# Altium project MRTRUMAN.PrjPcb (part 3 of 4)

## Sheet 04 DragonBoard_INTF.SchDoc
size 457 x 241 mm
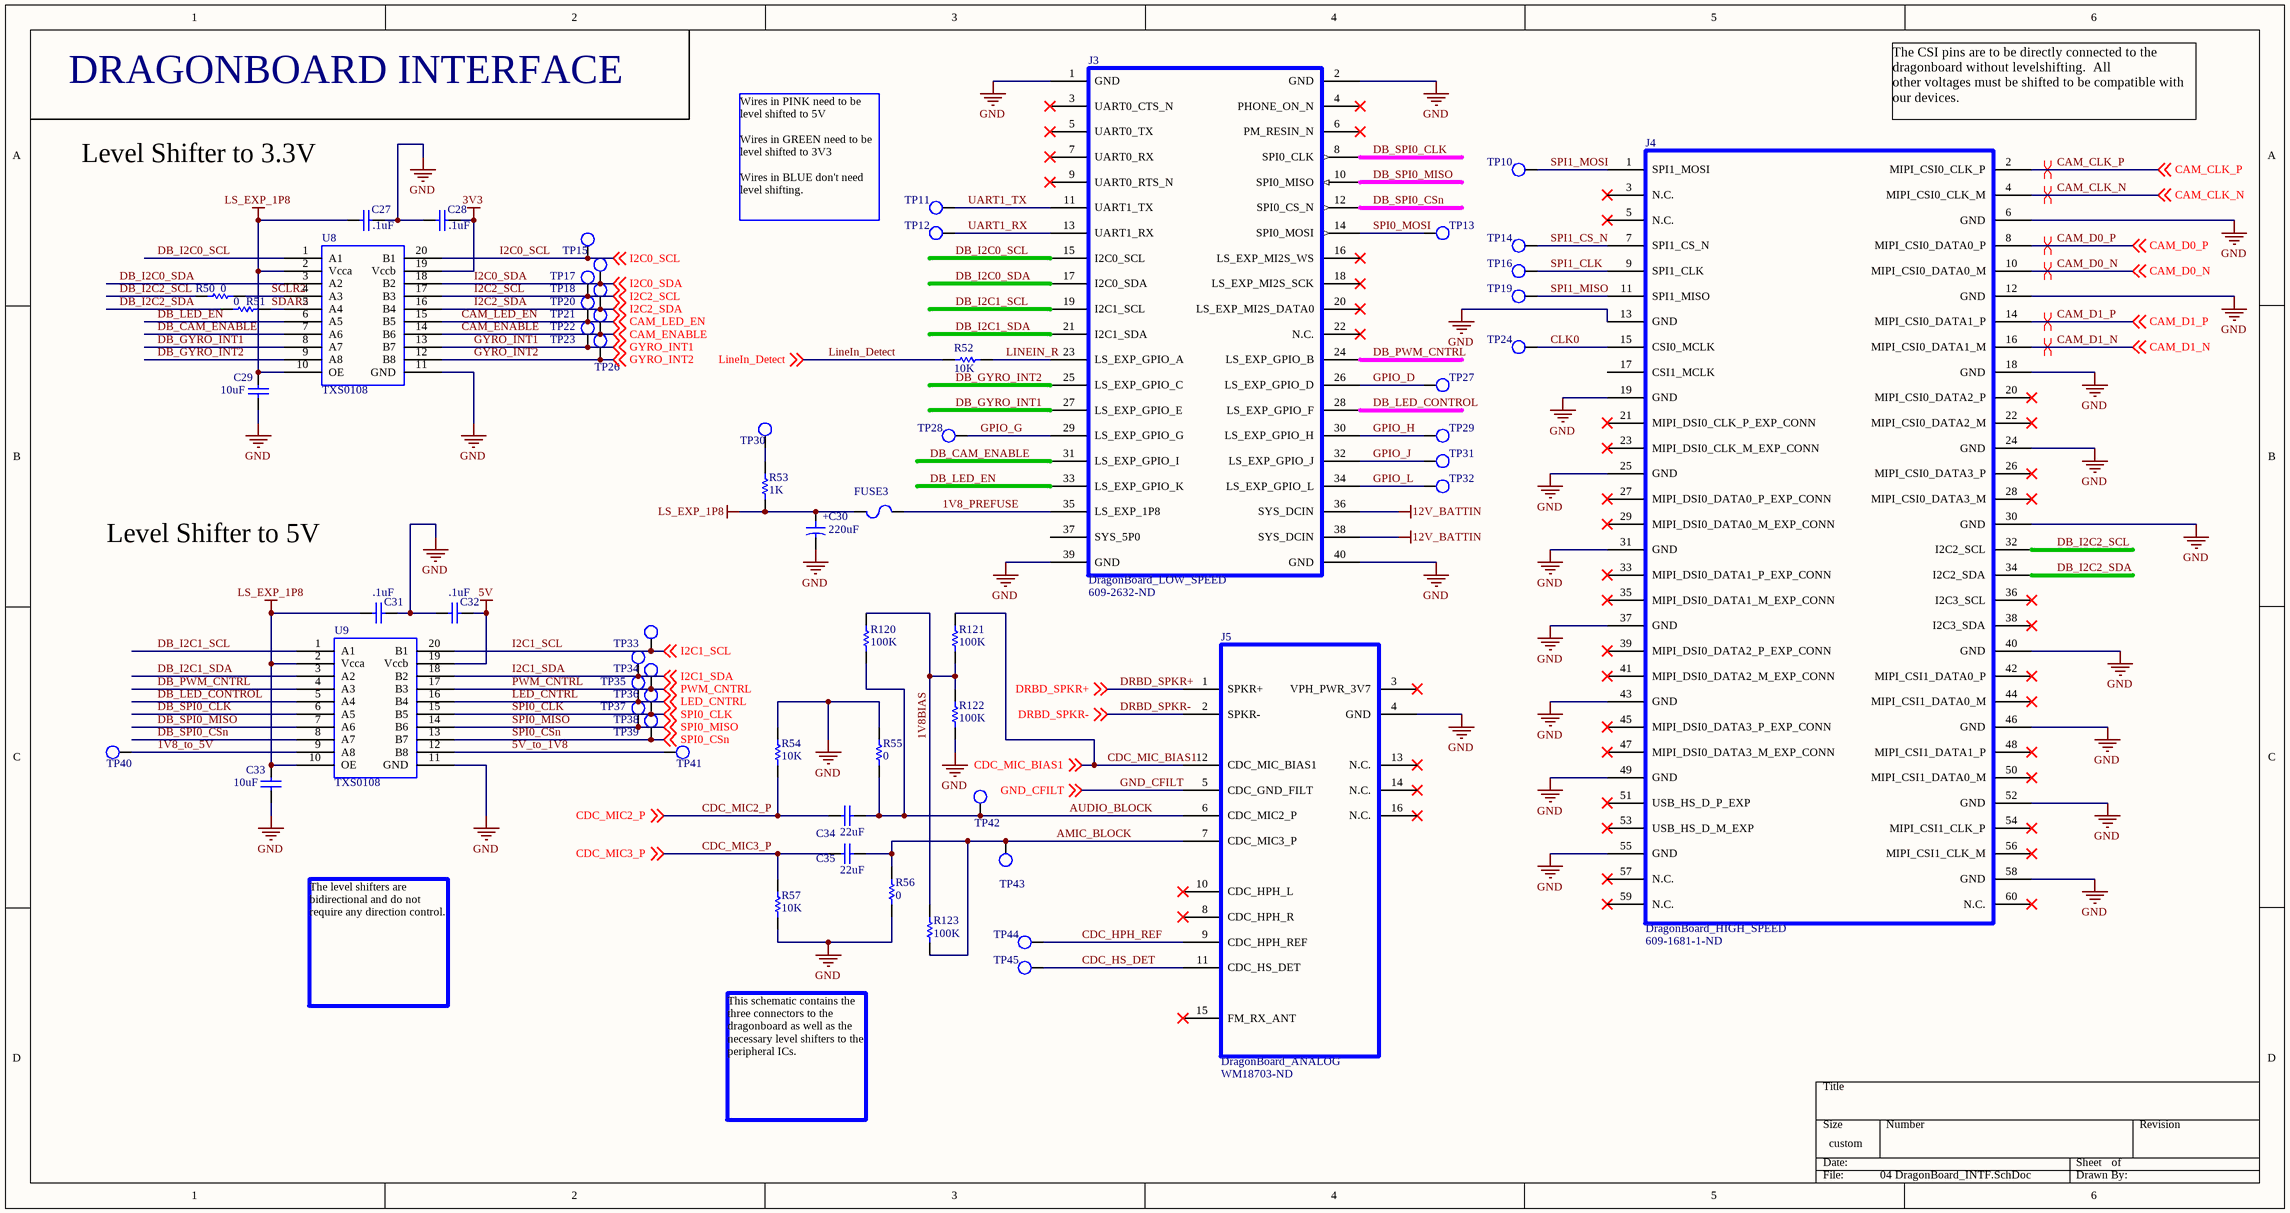
[diagram p3: 04 DragonBoard_INTF.SchDoc]

### Parts
C27  value .1uF  [CAPC2012X135N]  (hidden comment: CAP_0805_.1u_250V)
C28  value .1uF  [CAPC2012X135N]  (hidden comment: CAP_0805_.1u_250V)
C29  value 10uF  [CAPC2012X135N]  (hidden comment: CAP_0805_10u_16V)
C30  Capacitance: 220uF  [CAP_RADIAL]  (hidden comment: CAP ALUM 220UF 20% 25V SMD)
C31  value .1uF  [CAPC2012X135N]  (hidden comment: CAP_0805_.1u_250V)
C32  value .1uF  [CAPC2012X135N]  (hidden comment: CAP_0805_.1u_250V)
C33  value 10uF  [CAPC2012X135N]  (hidden comment: CAP_0805_10u_16V)
C34  value 22uF  [CAPC2012X135N]  (hidden comment: CAP_0805_22u_25V)
C35  value 22uF  [CAPC2012X135N]  (hidden comment: CAP_0805_22u_25V)
FUSE3  FUSE_0805_1A_32VDC  [RES0805]  (value not drawn)
J3  DragonBoard_LOW_SPEED  Supplier Part Number 1: 609-2632-ND  [57202_40_PIN_HEADER]
J4  DragonBoard_HIGH_SPEED  Supplier Part Number 1: 609-1681-1-ND  [DB_HIGH_SPEED]
J5  DragonBoard_ANALOG  Supplier Part Number 1: WM18703-ND  [16_PIN_ANALOG_CONN]
R50  RES_0805_JMP  [RES0805]  (value not drawn)
R51  RES_0805_JMP  [RES0805]  (value not drawn)
R52  Resistance: 10K  [RES0805]  (hidden comment: RES_0805_10K)
R53  RES_0805_1K  [RES0805]  (value not drawn)
R54  Resistance: 10K  [RES0805]  (hidden comment: RES_0805_10K)
R55  RES_0805_JMP  [RES0805]  (value not drawn)
R56  RES_0805_JMP  [RES0805]  (value not drawn)
R57  Resistance: 10K  [RES0805]  (hidden comment: RES_0805_10K)
R120  RES_0805_100K  [RES0805]  (value not drawn)
R121  RES_0805_100K  [RES0805]  (value not drawn)
R122  RES_0805_100K  [RES0805]  (value not drawn)
R123  RES_0805_100K  [RES0805]  (value not drawn)
TP10  TP  [TestPoint_0805]  (value not drawn)
TP11  TP  [TestPoint_0805]  (value not drawn)
TP12  TP  [TestPoint_0805]  (value not drawn)
TP13  TP  [TestPoint_0805]  (value not drawn)
TP14  TP  [TestPoint_0805]  (value not drawn)
TP15  TP  [TestPoint_0805]  (value not drawn)
TP16  TP  [TestPoint_0805]  (value not drawn)
TP17  TP  [TestPoint_0805]  (value not drawn)
TP18  TP  [TestPoint_0805]  (value not drawn)
TP19  TP  [TestPoint_0805]  (value not drawn)
TP20  TP  [TestPoint_0805]  (value not drawn)
TP21  TP  [TestPoint_0805]  (value not drawn)
TP22  TP  [TestPoint_0805]  (value not drawn)
TP23  TP  [TestPoint_0805]  (value not drawn)
TP24  TP  [TestPoint_0805]  (value not drawn)
TP26  TP  [TestPoint_0805]  (value not drawn)
TP27  TP  [TestPoint_0805]  (value not drawn)
TP28  TP  [TestPoint_0805]  (value not drawn)
TP29  TP  [TestPoint_0805]  (value not drawn)
TP30  TP  [TestPoint_0805]  (value not drawn)
TP31  TP  [TestPoint_0805]  (value not drawn)
TP32  TP  [TestPoint_0805]  (value not drawn)
TP33  TP  [TestPoint_0805]  (value not drawn)
TP34  TP  [TestPoint_0805]  (value not drawn)
TP35  TP  [TestPoint_0805]  (value not drawn)
TP36  TP  [TestPoint_0805]  (value not drawn)
TP37  TP  [TestPoint_0805]  (value not drawn)
TP38  TP  [TestPoint_0805]  (value not drawn)
TP39  TP  [TestPoint_0805]  (value not drawn)
TP40  TP  [TestPoint_0805]  (value not drawn)
TP41  TP  [TestPoint_0805]  (value not drawn)
TP42  TP  [TestPoint_0805]  (value not drawn)
TP43  TP  [TestPoint_0805]  (value not drawn)
TP44  TP  [TestPoint_0805]  (value not drawn)
TP45  TP  [TestPoint_0805]  (value not drawn)
U8  TXS0108  [TSSOP20]
U9  TXS0108  [TSSOP20]

### Nets
3V3: C28.2 U8.19(Vccb)
5V: C32.2 U9.19(Vccb)
12V_BATTIN: J3.36(SYS_DCIN) J3.38(SYS_DCIN)
GND: C27.2 C28.1 C29.1 C30.2 C31.2 C32.1 C33.1 J3.1(GND) J3.2(GND) J3.39(GND) J3.40(GND) J4.6(GND) J4.12(GND) J4.13(GND) J4.18(GND) J4.19(GND) J4.24(GND) J4.25(GND) J4.30(GND) J4.31(GND) J4.37(GND) J4.40(GND) J4.43(GND) J4.46(GND) J4.49(GND) J4.52(GND) J4.55(GND) J4.58(GND) J5.4(GND) R54.2 R55.2 R56.1 R57.1 R122.1 U8.11(GND) U9.11(GND)
LS_EXP_1P8: C27.1 C29.2 C30.1 C31.1 C33.2 FUSE3.1 R53.1 U8.2(Vcca) U8.10(OE) U9.2(Vcca) U9.10(OE)
1V8_PREFUSE: FUSE3.2 J3.35(LS_EXP_1P8)
1V8_to_5V: TP40.1 U9.9(A8)
1V8BIAS: R120.2 R121.1 R122.2 R123.2
5V_to_1V8: TP41.1 U9.12(B8)
AMIC_BLOCK: C35.2 J5.7(CDC_MIC3_P) R56.2 R123.1 TP43.1
AUDIO_BLOCK: C34.2 J5.6(CDC_MIC2_P) R55.1 R120.1 TP42.1
CAM_CLK_N: J4.4(MIPI_CSI0_CLK_M) ; off-sheet CAM_CLK_N
CAM_CLK_P: J4.2(MIPI_CSI0_CLK_P) ; off-sheet CAM_CLK_P
CAM_D0_N: J4.10(MIPI_CSI0_DATA0_M) ; off-sheet CAM_D0_N
CAM_D0_P: J4.8(MIPI_CSI0_DATA0_P) ; off-sheet CAM_D0_P
CAM_D1_N: J4.16(MIPI_CSI0_DATA1_M) ; off-sheet CAM_D1_N
CAM_D1_P: J4.14(MIPI_CSI0_DATA1_P) ; off-sheet CAM_D1_P
CAM_ENABLE: TP22.1 U8.14(B6) ; off-sheet CAM_ENABLE
CAM_LED_EN: TP21.1 U8.15(B5) ; off-sheet CAM_LED_EN
CDC_HPH_REF: J5.9(CDC_HPH_REF) TP44.1
CDC_HS_DET: J5.11(CDC_HS_DET) TP45.1
CDC_MIC2_P: C34.1 R54.1 ; off-sheet CDC_MIC2_P
CDC_MIC3_P: C35.1 R57.2 ; off-sheet CDC_MIC3_P
CDC_MIC_BIAS1: J5.12(CDC_MIC_BIAS1) R121.2 ; off-sheet CDC_MIC_BIAS1
CLK0: J4.15(CSI0_MCLK) TP24.1
DB_CAM_ENABLE: J3.31(LS_EXP_GPIO_I) U8.7(A6)
DB_GYRO_INT1: J3.27(LS_EXP_GPIO_E) U8.8(A7)
DB_GYRO_INT2: J3.25(LS_EXP_GPIO_C) U8.9(A8)
DB_I2C0_SCL: J3.15(I2C0_SCL) U8.1(A1)
DB_I2C0_SDA: J3.17(I2C0_SDA) U8.3(A2)
DB_I2C1_SCL: J3.19(I2C1_SCL) U9.1(A1)
DB_I2C1_SDA: J3.21(I2C1_SDA) U9.3(A2)
DB_I2C2_SCL: J4.32(I2C2_SCL) R50.1
DB_I2C2_SDA: J4.34(I2C2_SDA) R51.1
DB_LED_CONTROL: J3.28(LS_EXP_GPIO_F) U9.5(A4)
DB_LED_EN: J3.33(LS_EXP_GPIO_K) U8.6(A5)
DB_PWM_CNTRL: J3.24(LS_EXP_GPIO_B) U9.4(A3)
DB_SPI0_CLK: J3.8(SPI0_CLK) U9.6(A5)
DB_SPI0_CSn: J3.12(SPI0_CS_N) U9.8(A7)
DB_SPI0_MISO: J3.10(SPI0_MISO) U9.7(A6)
DRBD_SPKR+: J5.1(SPKR+) ; off-sheet DRBD_SPKR+
DRBD_SPKR-: J5.2(SPKR-) ; off-sheet DRBD_SPKR-
GND_CFILT: J5.5(CDC_GND_FILT) ; off-sheet GND_CFILT
GPIO_D: J3.26(LS_EXP_GPIO_D) TP27.1
GPIO_G: J3.29(LS_EXP_GPIO_G) TP28.1
GPIO_H: J3.30(LS_EXP_GPIO_H) TP29.1
GPIO_J: J3.32(LS_EXP_GPIO_J) TP31.1
GPIO_L: J3.34(LS_EXP_GPIO_L) TP32.1
GYRO_INT1: TP23.1 U8.13(B7) ; off-sheet GYRO_INT1
GYRO_INT2: TP26.1 U8.12(B8) ; off-sheet GYRO_INT2
I2C0_SCL: TP15.1 U8.20(B1) ; off-sheet I2C0_SCL
I2C0_SDA: TP17.1 U8.18(B2) ; off-sheet I2C0_SDA
I2C1_SCL: TP33.1 U9.20(B1) ; off-sheet I2C1_SCL
I2C1_SDA: TP34.1 U9.18(B2) ; off-sheet I2C1_SDA
I2C2_SCL: TP18.1 U8.17(B3) ; off-sheet I2C2_SCL
I2C2_SDA: TP20.1 U8.16(B4) ; off-sheet I2C2_SDA
LED_CNTRL: TP36.1 U9.16(B4) ; off-sheet LED_CNTRL
LineIn_Detect: R52.1 ; off-sheet LineIn_Detect
LINEIN_R: J3.23(LS_EXP_GPIO_A) R52.2
PWM_CNTRL: TP35.1 U9.17(B3) ; off-sheet PWM_CNTRL
SCLR2: R50.2 U8.4(A3)
SDAR2: R51.2 U8.5(A4)
SPI0_CLK: TP37.1 U9.15(B5) ; off-sheet SPI0_CLK
SPI0_CSn: TP39.1 U9.13(B7) ; off-sheet SPI0_CSn
SPI0_MISO: TP38.1 U9.14(B6) ; off-sheet SPI0_MISO
SPI0_MOSI: J3.14(SPI0_MOSI) TP13.1
SPI1_CLK: J4.9(SPI1_CLK) TP16.1
SPI1_CS_N: J4.7(SPI1_CS_N) TP14.1
SPI1_MISO: J4.11(SPI1_MISO) TP19.1
SPI1_MOSI: J4.1(SPI1_MOSI) TP10.1
UART1_RX: J3.13(UART1_RX) TP12.1
UART1_TX: J3.11(UART1_TX) TP11.1
NetR53_2: R53.2 TP30.1

Not connected (* = marked no-connect by the designer): J3 3(UART0_CTS_N)* 4(PHONE_ON_N)* 5(UART0_TX)* 6(PM_RESIN_N)* 7(UART0_RX)* 9(UART0_RTS_N)* 16(LS_EXP_MI2S_WS)* 18(LS_EXP_MI2S_SCK)* 20(LS_EXP_MI2S_DATA0)* 22(N.C.)* 37(SYS_5P0); J4 3(N.C.)* 5(N.C.)* 17(CSI1_MCLK) 20(MIPI_CSI0_DATA2_P)* 21(MIPI_DSI0_CLK_P_EXP_CONN)* 22(MIPI_CSI0_DATA2_M)* 23(MIPI_DSI0_CLK_M_EXP_CONN)* 26(MIPI_CSI0_DATA3_P)* 27(MIPI_DSI0_DATA0_P_EXP_CONN)* 28(MIPI_CSI0_DATA3_M)* 29(MIPI_DSI0_DATA0_M_EXP_CONN)* 33(MIPI_DSI0_DATA1_P_EXP_CONN)* 35(MIPI_DSI0_DATA1_M_EXP_CONN)* 36(I2C3_SCL)* 38(I2C3_SDA)* 39(MIPI_DSI0_DATA2_P_EXP_CONN)* 41(MIPI_DSI0_DATA2_M_EXP_CONN)* 42(MIPI_CSI1_DATA0_P)* 44(MIPI_CSI1_DATA0_M)* 45(MIPI_DSI0_DATA3_P_EXP_CONN)* 47(MIPI_DSI0_DATA3_M_EXP_CONN)* 48(MIPI_CSI1_DATA1_P)* 50(MIPI_CSI1_DATA0_M)* 51(USB_HS_D_P_EXP)* 53(USB_HS_D_M_EXP)* 54(MIPI_CSI1_CLK_P)* 56(MIPI_CSI1_CLK_M)* 57(N.C.)* 59(N.C.)* 60(N.C.)*; J5 3(VPH_PWR_3V7)* 8(CDC_HPH_R)* 10(CDC_HPH_L)* 13(N.C.)* 14(N.C.)* 15(FM_RX_ANT)* 16(N.C.)*

### Layout directives
differential pair: CAM_CLK_N, CAM_CLK_P, CAM_D0_N, CAM_D0_P, CAM_D1_N, CAM_D1_P

### Notes on the sheet
- DRAGONBOARD INTERFACE
- The CSI pins are to be directly connected to the dragonboard without levelshifting.  All
  other voltages must be shifted to be compatible with our devices.
- Level Shifter to 3.3V
- Wires in PINK need to be level shifted to 5V
  Wires in GREEN need to be level shifted to 3V3
  Wires in BLUE don't need level shifting.
- Level Shifter to 5V
- The level shifters are bidirectional and do not require any direction control.
- This schematic contains the three connectors to the dragonboard as well as the necessary level shifters to the peripheral ICs.
- (in symbol CAP_RAD_220u_25V) +
- (in symbol RES_0805_1K) 1K
- (in symbol RES_0805_100K) 100K
- (in symbol RES_0805_JMP) 0

### Library data of the parts
C27 C28 C31 C32 = CAP_0805_.1u_250V: Cap Ceramic 0.1uF 250V X7T 10% SMD 0805 125C Plastic T/R; Manufacturer: TDK; Manufacturer Part Number: C2012X7T2E104K125AE; Capacitance: 100nF; Supplier 1: Digi-Key; Supplier Part Number 1: 445-8883-1-ND; Stock 1: 30376; Pricing 1: 1=0.37, 10=0.25, 100=0.1419, 500=0.1002, 1000=0.0877 (USD); Case/Package: 0805; Weight: 0.000194oz; Case Code (Metric): 2012; Case Code (Imperial): 0805; Min Operating Temperature: -55°C; Max Operating Temperature: 125°C; Package Quantity: 1; Voltage Rating: 250V; Tolerance: 10%; Packaging: Tape and Reel; Voltage Rating (DC): 250V; Dielectric: X7T; Termination: SMD/SMT; Composition: Ceramic; Length: 2mm; Height: 1.25mm; Width: 0.05inch; Thickness: 0.049inch; Depth: 1.25mm; REACH SVHC: No SVHC; ComponentLink1URL: https://datasheet.ciiva.com/24219/c2012x7t2e104k125ae-265154-24219519.pdf; ComponentLink1Description: https://datasheet.ciiva.com/24219/c2012x7t2e104k125ae-265154-24219519.pdf
C29 C33 = CAP_0805_10u_16V: Cap Ceramic 10uF 16V X5R 10% SMD 0805 85C T/R; Manufacturer: Johanson Dielectrics; Manufacturer Part Number: 160R15X106KV4E; Supplier 1: Digi-Key; Supplier Part Number 1: 709-1229-1-ND; Stock 1: 36636; Pricing 1: 1=0.55, 10=0.387, 100=0.2552, 500=0.189, 1000=0.1607 (USD); Mount: Surface Mount; Case/Package: 0805; Number of Pins: 2; Weight: 0.000194oz; Case Code (Imperial): 0805; Case Code (Metric): 2012; Min Operating Temperature: -55°C; Max Operating Temperature: 85°C; Voltage Rating: 16V; Capacitance: 10uF; Voltage Rating (DC): 16V; Tolerance: 10%; Packaging: Tape and Reel; Package Quantity: 2000; Dielectric: X5R; Termination: SMD/SMT; Length: 2.03mm; Height: 1.27mm; Width: 1.27mm; Thickness: 0.06inch; Depth: 1.27mm; Radiation Hardening: No; REACH SVHC: No SVHC; ComponentLink1URL: https://datasheet.ciiva.com/26948/getdatasheetpartid-132904-26948555.pdf; ComponentLink1Description: https://datasheet.ciiva.com/26948/getdatasheetpartid-132904-26948555.pdf
C30 = CAP_RAD_220u_25V: Manufacturer: Nichicon; Manufacturer Part Number: UWT1E221MNL1GS; Dielectric Material: Aluminium; Ripple Current: 155mA; Leakage Current: 3uA; Life (Hours): 1000Hour; Dissipation Factor: 0.16%; Supplier 1: Digi-Key; Stock 1: 22315; Pricing 1: 1=0.44, 10=0.309, 100=0.2034 (USD); Mount: Surface Mount; Case/Package: SMD/SMT; Number of Pins: 2; Min Operating Temperature: -55°C; Max Operating Temperature: 105°C; Tolerance: 20%; Package Quantity: 500; Voltage Rating: 25V; Packaging: Tape and Reel; Ripple Current (AC): 155mA; Voltage Rating (DC): 25V; Termination: SMD/SMT; Voltage: 25V; Diameter: 8mm; Length: 10mm; Height: 10mm; Height - Seated (Max): 0.394inch; Lead Pitch: 3.1mm; Radiation Hardening: No; REACH SVHC: No SVHC; Lead Free: Lead Free; ComponentLink1URL: https://datasheet.ciiva.com/97/e-wt-97056.pdf; ComponentLink1Description: https://datasheet.ciiva.com/97/e-wt-97056.pdf; ComponentLink2URL: https://datasheet.ciiva.com/97/e-wt-97057.pdf; ComponentLink2Description: https://datasheet.ciiva.com/97/e-wt-97057.pdf; ComponentLink3URL: https://datasheet.ciiva.com/30522/getdatasheetpartid-450026-30522226.pdf; ComponentLink3Description: https://datasheet.ciiva.com/30522/getdatasheetpartid-450026-30522226.pdf; ComponentLink4URL: https://datasheet.ciiva.com/5360/e-wt-30307-5360729.pdf; ComponentLink4Description: https://datasheet.ciiva.com/5360/e-wt-30307-5360729.pdf; ComponentLink5URL: https://datasheet.ciiva.com/7851/e-wt-7851755.pdf; ComponentLink5Description: https://datasheet.ciiva.com/7851/e-wt-7851755.pdf; ComponentLink6URL: https://datasheet.ciiva.com/17526/e-wt-17526956.pdf; ComponentLink6Description: https://datasheet.ciiva.com/17526/e-wt-17526956.pdf; ComponentLink7URL: https://datasheet.ciiva.com/28458/1910938-28458412.pdf; ComponentLink7Description: https://datasheet.ciiva.com/28458/1910938-28458412.pdf; ComponentLink8URL: https://datasheet.ciiva.com/97/e-wt-97055.pdf; ComponentLink8Description: https://datasheet.ciiva.com/97/e-wt-97055.pdf; Supplier Part Number 1: 493-2192-1-ND
C34 C35 = CAP_0805_22u_25V: 22µF ±20% 25V X5R Ceramic Capacitor -55°C ~ 85°C Surface Mount, MLCC 0805 (2012 Metric) 0.079" L x 0.049" W (2.00mm x 1.25mm); Manufacturer: Samsung; Manufacturer Part Number: CL21A226MAQNNNE; Supplier 1: Digi-Key; Supplier Part Number 1: 1276-2908-1-ND; Stock 1: 536403; Pricing 1: 1=0.92, 10=0.678, 100=0.465, 500=0.3681, 1000=0.31 (USD); Mount: Surface Mount; Case/Package: 0805; Case Code (Metric): 2012; Case Code (Imperial): 0805; Contact Plating: Nickel,Tin; Min Operating Temperature: -55°C; Max Operating Temperature: 85°C; Package Quantity: 1; Packaging: Tape and Reel; Capacitance: 22uF; Tolerance: 20%; Voltage Rating: 25V; Dielectric: X5R; Termination: Wraparound; Length: 2mm; Width: 0.049inch; Thickness: 0.055inch; Depth: 1.25mm; ComponentLink1URL: https://datasheet.ciiva.com/25724/cl21a226maqnnne-25724468.pdf; ComponentLink1Description: https://datasheet.ciiva.com/25724/cl21a226maqnnne-25724468.pdf
FUSE3 = FUSE_0805_1A_32VDC: FUSE 1.00A 0805 VFAST SMD; Manufacturer: Vishay; Manufacturer Part Number: MFU0805FF01000P100; Voltage Rating (DC): 32V; Current Rating: 1A; DC Cold Resistance: 185mR; Approvals: UL; Supplier 1: Digi-Key; Stock 1: 41804; Pricing 1: 1=0.49, 5=0.474, 10=0.459, 50=0.3866, 100=0.3209, 250=0.2917, 500=0.248 (USD); Mount: Surface Mount; Case/Package: 0805; Case Code (Metric): 2012; Case Code (Imperial): 0805; Housing Material: Ceramic; Min Operating Temperature: -55°C; Max Operating Temperature: 125°C; Package Quantity: 1000; Packaging: Tape and Reel; Fuse Current: 1A; Length: 0.079inch; Height: 0.018inch; Width: 0.049inch; Depth: 1.25mm; REACH SVHC: Unknown; Lead Free: Lead Free; ComponentLink1URL: https://datasheet.ciiva.com/22662/1913674-22662919.pdf; ComponentLink1Description: https://datasheet.ciiva.com/22662/1913674-22662919.pdf; ComponentLink2URL: https://datasheet.ciiva.com/3018/mfuserie-3018078.pdf; ComponentLink2Description: https://datasheet.ciiva.com/3018/mfuserie-3018078.pdf; Supplier Part Number 1: MFU08051.00CT-ND
J3 = DragonBoard_LOW_SPEED: 40 Positions Header, Unshrouded Connector 0.079" (2.00mm) Surface Mount Gold, GXT™; Manufacturer: Amphenol FCI; Manufacturer Part Number: 57202-G52-20LF; Number of Positions: 40; Insulation Resistance: 1GR; Max Voltage Rating (AC): 650V; Gender: Male; Connector Type: Male Pin; Contact Resistance: 25mR; Current Rating: 2A; Pitch: 2mm; Row Spacing: 0.079inch; Mating Post Length: 4mm; Supplier 1: Digi-Key; Stock 1: 3189; Pricing 1: 1=4.58, 10=4.395, 100=3.6624, 500=3.113, 1000=2.6552 (USD); Mount: Surface Mount; Contact Plating: Nickel,Gold,GXT; Contact Material: Bronze,Copper Alloy; Colour: Black; Housing Colour: Black; Housing Material: Thermoplastic; Min Operating Temperature: -55°C; Max Operating Temperature: 125°C; Package Quantity: 100; Packaging: Bulk; Number of Rows: 2; Termination: Solder; Number of Contacts: 40; Orientation: Straight; Contact Gender: Male; Voltage Rating: 650V; Length: 40mm; Depth: 4mm; Width: 4mm; Contact Mating Length: 0.157inch; Radiation Hardening: No; REACH SVHC: No SVHC; Lead Free: Lead Free; ComponentLink1URL: https://datasheet.ciiva.com/9473/57202-9473862.pdf; ComponentLink1Description: https://datasheet.ciiva.com/9473/57202-9473862.pdf; ComponentLink2URL: https://datasheet.ciiva.com/711/57202-711726.pdf; ComponentLink2Description: https://datasheet.ciiva.com/711/57202-711726.pdf
J4 = DragonBoard_HIGH_SPEED: 60 Position Connector Plug, Center Strip Contacts Surface Mount Gold; Manufacturer: Amphenol FCI; Manufacturer Part Number: 61083-064402LF; Contact Resistance: 50mR; Number of Positions: 60; Max Voltage Rating (AC): 100V; Current Rating: 500mA; Gender: Male; Pitch: 0.8mm; Stack Height: 7.7mm; Supplier 1: Digi-Key; Stock 1: 579; Pricing 1: 1=6.36, 10=6.094, 25=5.5644, 50=5.2994, 100=5.0344, 250=4.5044 (USD); Mount: Surface Mount; Case/Package: SMD/SMT; Contact Plating: Nickel,Gold; Contact Material: Brass,Copper Alloy; Housing Material: Polymer; Min Operating Temperature: -40°C; Max Operating Temperature: 125°C; Number of Rows: 2; Packaging: Tape and Reel; Package Quantity: 600; Connector Type: Plug; Termination: Solder; Number of Contacts: 60; Orientation: Straight; Voltage Rating: 100V; Length: 29.8mm; Depth: 6mm; Width: 6mm; Lead Free: Lead Free; Flammability Rating: UL94 V-0; ComponentLink1URL: https://datasheet.ciiva.com/15208/getdatasheetpartid-64898-15208309.pdf; ComponentLink1Description: https://datasheet.ciiva.com/15208/getdatasheetpartid-64898-15208309.pdf; ComponentLink2URL: https://datasheet.ciiva.com/17088/70248518-17088294.pdf; ComponentLink2Description: https://datasheet.ciiva.com/17088/70248518-17088294.pdf; ComponentLink3URL: https://datasheet.ciiva.com/394/61083-394311.pdf; ComponentLink3Description: https://datasheet.ciiva.com/394/61083-394311.pdf; ComponentLink4URL: https://datasheet.ciiva.com/5129/61083-5129495.pdf; ComponentLink4Description: https://datasheet.ciiva.com/5129/61083-5129495.pdf; ComponentLink5URL: https://datasheet.ciiva.com/10034/61083-10034439.pdf; ComponentLink5Description: https://datasheet.ciiva.com/10034/61083-10034439.pdf; ComponentLink6URL: https://datasheet.ciiva.com/394/61083-394312.pdf; ComponentLink6Description: https://datasheet.ciiva.com/394/61083-394312.pdf; ComponentLink7URL: https://datasheet.ciiva.com/394/61083-394313.pdf; ComponentLink7Description: https://datasheet.ciiva.com/394/61083-394313.pdf
J5 = DragonBoard_ANALOG: Conn Socket Strip RCP 16 POS 2mm Solder ST SMD Tube; Manufacturer: Molex; Manufacturer Part Number: 0791091007; Connector Type: Receptacle,Socket; Number of Positions: 16; Gender: Female; Max Voltage Rating (AC): 125V; Contact Resistance: 25mR; Row Spacing: 0.079inch; Supplier 1: Digi-Key; Stock 1: 8937; Pricing 1: 1=2.66, 10=2.554, 100=2.1284, 500=1.8091, 1000=1.5431, 5000=1.3835 (USD); Case/Package: SMD/SMT; Colour: Black; Contact Plating: Nickel,Gold; Contact Material: Bronze; Housing Colour: Black; Housing Material: Polymer; Min Operating Temperature: -55°C; Max Operating Temperature: 105°C; Packaging: Rail/Tube; Number of Rows: 2; Termination: Solder; Number of Contacts: 16; Orientation: Straight; Length: 16.19mm; Pitch: 2mm; Depth: 4.19mm; ComponentLink1URL: https://datasheet.ciiva.com/10078/0791091007-pcb-receptacles-10078749.pdf; ComponentLink1Description: https://datasheet.ciiva.com/10078/0791091007-pcb-receptacles-10078749.pdf
R50 R51 R55 R56 = RES_0805_JMP: RES, THICK FILM, 0R, 0.125W, 0805; Manufacturer: Yageo; Manufacturer Part Number: RC0805JR-070RL; Resistance: 0mR; Tolerance: 5%; Voltage Rating: 150V; Power Rating: 125mW; Temperature Coefficient: 200ppm/°C; Supplier 1: Digi-Key; Supplier Part Number 1: 311-0.0ARCT-ND; Stock 1: 6469744; Pricing 1: 1=0.1, 10=0.018, 25=0.0128, 50=0.0096, 100=0.0071, 250=0.0054, 500=0.0044, 1000=0.0032 (USD); Case/Package: 0805; Number of Pins: 2; Case Code (Imperial): 0805; Case Code (Metric): 2012; Contact Plating: Tin,Matte; Min Operating Temperature: -55°C; Max Operating Temperature: 155°C; Packaging: Tape and Reel; Voltage Rating (DC): 150V; Termination: SMD/SMT; Composition: Thick Film; Military Standard: Not; Length: 2mm; Height: 0.5mm; Width: 1.25mm; Depth: 1.25mm; Radiation Hardening: No; REACH SVHC: Unknown; Lead Free: Lead Free; ComponentLink1URL: https://datasheet.ciiva.com/7941/1738694-7941861.pdf; ComponentLink1Description: https://datasheet.ciiva.com/7941/1738694-7941861.pdf; ComponentLink2URL: https://datasheet.ciiva.com/7941/1738694-7941862.pdf; ComponentLink2Description: https://datasheet.ciiva.com/7941/1738694-7941862.pdf; ComponentLink3URL: https://datasheet.ciiva.com/11819/0900766b8106beab-11819430.pdf; ComponentLink3Description: https://datasheet.ciiva.com/11819/0900766b8106beab-11819430.pdf; ComponentLink4URL: https://datasheet.ciiva.com/7941/1738694-7941863.pdf; ComponentLink4Description: https://datasheet.ciiva.com/7941/1738694-7941863.pdf; ComponentLink5URL: https://datasheet.ciiva.com/15190/getdatasheetpartid-330685-15190028.pdf; ComponentLink5Description: https://datasheet.ciiva.com/15190/getdatasheetpartid-330685-15190028.pdf
R52 R54 R57 = RES_0805_10K: RES, THICK FILM, 10K, 5%, 0.125W, 0805; Manufacturer: Yageo; Manufacturer Part Number: RC0805JR-0710KL; Power Rating: 125mW; Voltage Rating: 150V; Temperature Coefficient: 100ppm/°C; Supplier 1: Digi-Key; Stock 1: 1285290; Pricing 1: 1=0.1, 10=0.019, 100=0.0076, 1000=0.0034, 2500=0.003 (USD); Case/Package: 0805; Case Code (Imperial): 0805; Case Code (Metric): 2012; Contact Plating: Tin,Matte; Min Operating Temperature: -55°C; Max Operating Temperature: 155°C; Tolerance: 5%; Packaging: Tape and Reel; Termination: SMD/SMT; Composition: Thick Film; Military Standard: Not; Length: 2mm; Height: 0.5mm; Depth: 1.25mm; Width: 1.25mm; Radiation Hardening: No; REACH SVHC: Unknown; Lead Free: Lead Free; ComponentLink1URL: https://datasheet.ciiva.com/7983/444164-7983765.pdf; ComponentLink1Description: https://datasheet.ciiva.com/7983/444164-7983765.pdf; ComponentLink2URL: https://datasheet.ciiva.com/7941/444164-7941870.pdf; ComponentLink2Description: https://datasheet.ciiva.com/7941/444164-7941870.pdf; ComponentLink3URL: https://datasheet.ciiva.com/7941/444164-7941871.pdf; ComponentLink3Description: https://datasheet.ciiva.com/7941/444164-7941871.pdf; Supplier Part Number 1: 311-10KARCT-ND
R53 = RES_0805_1K: RES SMD 1K OHM 1% 1/8W 0805; Manufacturer: Yageo; Manufacturer Part Number: RC0805FR-071KL; Resistance: 1KR; Temperature Coefficient: 100ppm/°C; Voltage Rating (DC): 150V; Power Rating: 125mW; Supplier 1: Digi-Key; Supplier Part Number 1: 311-1.00KCRCT-ND; Stock 1: 6122451; Pricing 1: 1=0.1, 10=0.022, 100=0.0088, 1000=0.004, 2500=0.0034 (USD); Case/Package: 0805; Number of Pins: 2; Case Code (Metric): 2012; Case Code (Imperial): 0805; Min Operating Temperature: -55°C; Max Operating Temperature: 155°C; Tolerance: 1%; Packaging: Tape and Reel; Composition: Thick Film; Package Quantity: 1; Voltage Rating: 150V; Number of Terminations: 2; Termination: SMD/SMT; Military Standard: Not; Max Power Dissipation: 125mW; Length: 0.079inch; Height: 0.024inch; Width: 0.049inch; Depth: 1.25mm; REACH SVHC: Unknown; Lead Free: Lead Free; ComponentLink1URL: https://datasheet.ciiva.com/2456/pyu-r-int-thick-7-2456976.pdf; ComponentLink1Description: https://datasheet.ciiva.com/2456/pyu-r-int-thick-7-2456976.pdf; ComponentLink2URL: https://datasheet.ciiva.com/2456/pyu-r-int-thick-7-2456977.pdf; ComponentLink2Description: https://datasheet.ciiva.com/2456/pyu-r-int-thick-7-2456977.pdf; ComponentLink3URL: https://datasheet.ciiva.com/11819/0900766b8106beab-11819814.pdf; ComponentLink3Description: https://datasheet.ciiva.com/11819/0900766b8106beab-11819814.pdf; ComponentLink4URL: https://datasheet.ciiva.com/7941/1686128-7941719.pdf; ComponentLink4Description: https://datasheet.ciiva.com/7941/1686128-7941719.pdf; ComponentLink5URL: https://datasheet.ciiva.com/16850/rc0805-16850409.pdf; ComponentLink5Description: https://datasheet.ciiva.com/16850/rc0805-16850409.pdf; ComponentLink6URL: https://datasheet.ciiva.com/46385/444164-46385020.pdf; ComponentLink6Description: https://datasheet.ciiva.com/46385/444164-46385020.pdf; ComponentLink7URL: https://datasheet.ciiva.com/2456/pyu-r-int-thick-7-2456975.pdf; ComponentLink7Description: https://datasheet.ciiva.com/2456/pyu-r-int-thick-7-2456975.pdf
R120-R123 = RES_0805_100K: Res Thick Film 0805 100K Ohm 1% 0.125W(1/8W) ±100ppm/C Molded SMD Automotive Punched T/R; Manufacturer: Panasonic ECG; Manufacturer Part Number: ERJ-6ENF1003V; Resistance: 100KR; Power Rating: 125mW; Temperature Coefficient: 100ppm/°C; Voltage Rating (DC): 150V; Supplier 1: Digi-Key; Supplier Part Number 1: P100KCCT-ND; Stock 1: 219769; Pricing 1: 1=0.1, 10=0.041, 100=0.0167, 1000=0.0075, 2500=0.0065 (USD); Mount: Surface Mount; Case/Package: 0805; Number of Pins: 2; Case Code (Metric): 2012; Case Code (Imperial): 0805; Contact Plating: Tin; Min Operating Temperature: -55°C; Max Operating Temperature: 155°C; Tolerance: 1%; Packaging: Tape and Reel; Package Quantity: 1; Voltage Rating: 150V; Composition: Thick Film; Number of Terminations: 2; Military Standard: Not; Termination: SMD/SMT; Max Power Dissipation: 125mW; Length: 2mm; Height: 0.6mm; Width: 0.049inch; Depth: 1.25mm; Radiation Hardening: No; REACH SVHC: No SVHC; Lead Free: Lead Free; ComponentLink1URL: https://datasheet.ciiva.com/11821/0900766b80f80784-11821507.pdf; ComponentLink1Description: https://datasheet.ciiva.com/11821/0900766b80f80784-11821507.pdf; ComponentLink2URL: https://datasheet.ciiva.com/22723/426256-22723909.pdf; ComponentLink2Description: https://datasheet.ciiva.com/22723/426256-22723909.pdf; ComponentLink3URL: https://datasheet.ciiva.com/46419/1678782-46419877.pdf; ComponentLink3Description: https://datasheet.ciiva.com/46419/1678782-46419877.pdf; ComponentLink4URL: https://datasheet.ciiva.com/27055/1988989-27055734.pdf; ComponentLink4Description: https://datasheet.ciiva.com/27055/1988989-27055734.pdf; ComponentLink5URL: https://datasheet.ciiva.com/16449/aoa0000ce2-16449480.pdf; ComponentLink5Description: https://datasheet.ciiva.com/16449/aoa0000ce2-16449480.pdf; ComponentLink6URL: https://datasheet.ciiva.com/17208/aoa0000ce2-17208153.pdf; ComponentLink6Description: https://datasheet.ciiva.com/17208/aoa0000ce2-17208153.pdf; ComponentLink7URL: https://datasheet.ciiva.com/22667/1678782-22667897.pdf; ComponentLink7Description: https://datasheet.ciiva.com/22667/1678782-22667897.pdf; ComponentLink8URL: https://datasheet.ciiva.com/24023/aoa0000ce2-24023497.pdf; ComponentLink8Description: https://datasheet.ciiva.com/24023/aoa0000ce2-24023497.pdf; ComponentLink9URL: https://datasheet.ciiva.com/7830/426256-7830746.pdf; ComponentLink9Description: https://datasheet.ciiva.com/7830/426256-7830746.pdf; ComponentLink10URL: https://datasheet.ciiva.com/30257/aoa0000ce2-30257690.pdf; ComponentLink10Description: https://datasheet.ciiva.com/30257/aoa0000ce2-30257690.pdf; ComponentLink11URL: https://datasheet.ciiva.com/7830/426256-7830988.pdf; ComponentLink11Description: https://datasheet.ciiva.com/7830/426256-7830988.pdf; ComponentLink12URL: https://datasheet.ciiva.com/16776/70260748-16776892.pdf; ComponentLink12Description: https://datasheet.ciiva.com/16776/70260748-16776892.pdf; ComponentLink13URL: https://datasheet.ciiva.com/16788/70260748-16788734.pdf; ComponentLink13Description: https://datasheet.ciiva.com/16788/70260748-16788734.pdf; ComponentLink14URL: https://datasheet.ciiva.com/48531/aoa0000ce2-48531486.pdf; ComponentLink14Description: https://datasheet.ciiva.com/48531/aoa0000ce2-48531486.pdf
TP10-TP24 TP26-TP45 = TP: Testpoint_0805; Manufacturer: TE Connectivity; Manufacturer Part Number: 1625854-2; Resistance: 0mR; Supplier 1: Digi-Key; Stock 1: 27299; Pricing 1: 1=0.21, 10=0.2, 25=0.1708, 50=0.1496, 100=0.1389, 250=0.1229, 500=0.1175, 1000=0.0962 (USD); Case/Package: 0805; Colour: Natural; Min Operating Temperature: -55°C; Max Operating Temperature: 125°C; Packaging: Tape and Reel; Package Quantity: 2000; Military Standard: Not; Length: 2mm; Depth: 1.2mm; Radiation Hardening: No; Lead Free: Lead Free; ComponentLink1URL: https://datasheet.ciiva.com/6439/eng-ds-1773266-a-6439169.pdf; ComponentLink1Description: https://datasheet.ciiva.com/6439/eng-ds-1773266-a-6439169.pdf; ComponentLink2URL: https://datasheet.ciiva.com/30238/1773266-a-30238966.pdf; ComponentLink2Description: https://datasheet.ciiva.com/30238/1773266-a-30238966.pdf; ComponentLink3URL: https://datasheet.ciiva.com/8914/eng-ds-1773266-a-8914649.pdf; ComponentLink3Description: https://datasheet.ciiva.com/8914/eng-ds-1773266-a-8914649.pdf; Supplier Part Number 1: A106144CT-ND; Mount: Surface Mount
U8 U9 = TXS0108: TRANSLATOR, VOLTAGE, 8BIT, 20TSSOP; Manufacturer: Texas Instruments; Manufacturer Part Number: TXS0108EPWR; Output Current: 620µA; Propagation Delay: 4.8ns; Logic Case Style: TSSOP; No. of Pins: 20; Supply Voltage Min: 1.2V; Logic Type: Voltage Level Translator; Supply Voltage Max: 5.5V; No. of Inputs: 8; SVHC: No SVHC (16-Jun-2014); Supplier 1: Digi-Key; Stock 1: 41812; Pricing 1: 1=1.7, 10=1.523, 100=1.2242, 500=1.0058, 1000=0.8334 (USD); Operating Temperature Min: -40°C; Operating Temperature Max: 85°C; Packaging: Cut Tape; MSL: MSL 1 - Unlimited; ComponentLink1URL: https://datasheet.ciiva.com/14287/txs0108e-14287280.pdf; ComponentLink1Description: https://datasheet.ciiva.com/14287/txs0108e-14287280.pdf; ComponentLink2URL: https://datasheet.ciiva.com/4834/sces642b-127094-4834401.pdf; ComponentLink2Description: https://datasheet.ciiva.com/4834/sces642b-127094-4834401.pdf; ComponentLink3URL: https://datasheet.ciiva.com/30509/txs0108epwr-30509699.pdf; ComponentLink3Description: https://datasheet.ciiva.com/30509/txs0108epwr-30509699.pdf; ComponentLink4URL: https://datasheet.ciiva.com/1899/txs0108e-1899604.pdf; ComponentLink4Description: https://datasheet.ciiva.com/1899/txs0108e-1899604.pdf; ComponentLink5URL: https://datasheet.ciiva.com/15096/getdatasheetpartid-322119-15096276.pdf; ComponentLink5Description: https://datasheet.ciiva.com/15096/getdatasheetpartid-322119-15096276.pdf; ComponentLink6URL: https://datasheet.ciiva.com/1899/txs0108e-1899605.pdf; ComponentLink6Description: https://datasheet.ciiva.com/1899/txs0108e-1899605.pdf; ComponentLink7URL: https://datasheet.ciiva.com/28653/1714661-28653429.pdf; ComponentLink7Description: https://datasheet.ciiva.com/28653/1714661-28653429.pdf; ComponentLink8URL: https://datasheet.ciiva.com/1899/txs0108e-1899606.pdf; ComponentLink8Description: https://datasheet.ciiva.com/1899/txs0108e-1899606.pdf; ComponentLink9URL: https://datasheet.ciiva.com/1508/1815244-1508732.pdf; ComponentLink9Description: https://datasheet.ciiva.com/1508/1815244-1508732.pdf; ComponentLink10URL: https://datasheet.ciiva.com/14287/txs0108e-14287532.pdf; ComponentLink10Description: https://datasheet.ciiva.com/14287/txs0108e-14287532.pdf; ComponentLink11URL: https://datasheet.ciiva.com/26039/txs0108e-26039599.pdf; ComponentLink11Description: https://datasheet.ciiva.com/26039/txs0108e-26039599.pdf; Supplier Part Number 1: 296-23011-1-ND

## Sheet 05 SERVO_FAN.SchDoc
size A
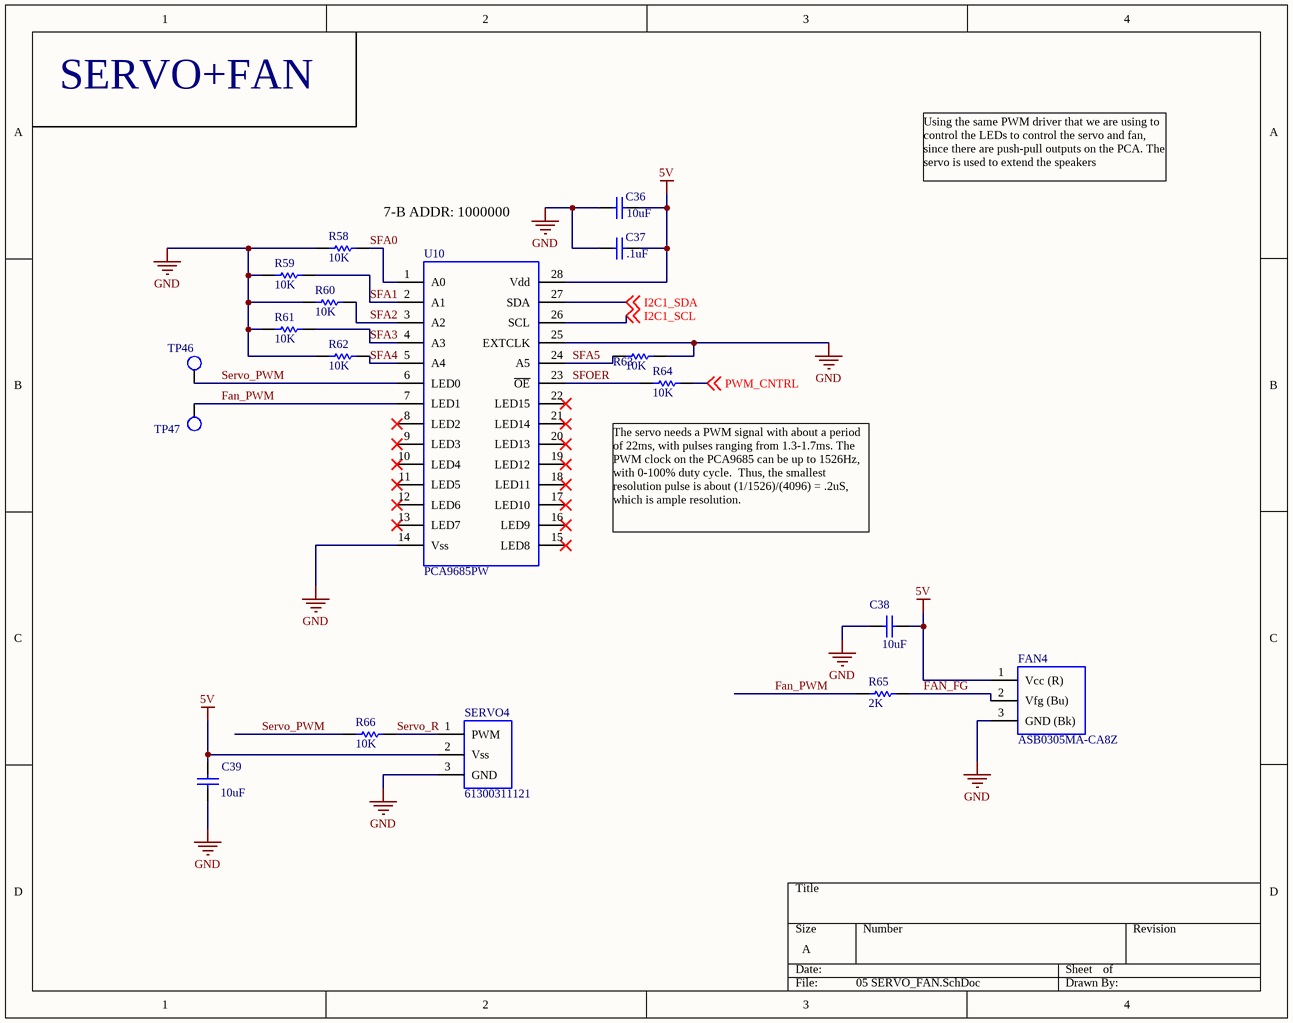
[diagram p4: 05 SERVO_FAN.SchDoc]

### Parts
C36  value 10uF  [CAPC2012X135N]  (hidden comment: CAP_0805_10u_16V)
C37  value .1uF  [CAPC2012X135N]  (hidden comment: CAP_0805_.1u_250V)
C38  value 10uF  [CAPC2012X135N]  (hidden comment: CAP_0805_10u_16V)
C39  value 10uF  [CAPC2012X135N]  (hidden comment: CAP_0805_10u_16V)
FAN4  ASB0305MA-CA8Z  [FAN_HEADER]
R58  Resistance: 10K  [RES0805]  (hidden comment: RES_0805_10K)
R59  Resistance: 10K  [RES0805]  (hidden comment: RES_0805_10K)
R60  Resistance: 10K  [RES0805]  (hidden comment: RES_0805_10K)
R61  Resistance: 10K  [RES0805]  (hidden comment: RES_0805_10K)
R62  Resistance: 10K  [RES0805]  (hidden comment: RES_0805_10K)
R63  Resistance: 10K  [RES0805]  (hidden comment: RES_0805_10K)
R64  Resistance: 10K  [RES0805]  (hidden comment: RES_0805_10K)
R65  RES_0805_2K  [RES0805]  (value not drawn)
R66  Resistance: 10K  [RES0805]  (hidden comment: RES_0805_10K)
SERVO4  61300311121  [SERVO_HEADER]
TP46  TP  [TestPoint_0805]  (value not drawn)
TP47  TP  [TestPoint_0805]  (value not drawn)
U10  PCA9685PW  [TSSOP28]

### Nets
5V: C36.2 C37.2 C38.1 C39.2 FAN4.1(Vcc_(R)) SERVO4.2(Vss) U10.28(Vdd)
GND: C36.1 C37.1 C38.2 C39.1 FAN4.3(GND_(Bk)) R58.1 R59.1 R60.1 R61.1 R62.1 R63.2 SERVO4.3(GND) U10.14(Vss) U10.25(EXTCLK)
FAN_FG: FAN4.2(Vfg_(Bu)) R65.2
Fan_PWM: R65.1 TP47.1 U10.7(LED1)
I2C1_SCL: U10.26(SCL) ; off-sheet I2C1_SCL
I2C1_SDA: U10.27(SDA) ; off-sheet I2C1_SDA
PWM_CNTRL: R64.2 ; off-sheet PWM_CNTRL
Servo_PWM: R66.1 TP46.1 U10.6(LED0)
Servo_R: R66.2 SERVO4.1(PWM)
SFA0: R58.2 U10.1(A0)
SFA1: R59.2 U10.2(A1)
SFA2: R60.2 U10.3(A2)
SFA3: R61.2 U10.4(A3)
SFA4: R62.2 U10.5(A4)
SFA5: R63.1 U10.24(A5)
SFOER: R64.1 U10.23(~{OE})

Not connected (* = marked no-connect by the designer): U10 8(LED2)* 9(LED3)* 10(LED4)* 11(LED5)* 12(LED6)* 13(LED7)* 15(LED8)* 16(LED9)* 17(LED10)* 18(LED11)* 19(LED12)* 20(LED13)* 21(LED14)* 22(LED15)*

### Notes on the sheet
- SERVO+FAN
- 7-B ADDR: 1000000
- Using the same PWM driver that we are using to control the LEDs to control the servo and fan, since there are push-pull outputs on the PCA. The servo is used to extend the speakers
- (near R64) The servo needs a PWM signal with about a period of 22ms, with pulses ranging from 1.3-1.7ms. The PWM clock on the PCA9685 can be up to 1526Hz, with 0-100% duty cycle.  Thus, the smallest resolution pulse is about (1/1526)/(4096) = .2uS, which is ample resolution.
- (in symbol RES_0805_2K) 2K

### Library data of the parts
C36 C38 C39 = CAP_0805_10u_16V: as C29 on sheet 04 DragonBoard_INTF; Supplier 1: Digi-Key; Supplier Part Number 1: 709-1229-1-ND; Stock 1: 36636; Pricing 1: 1=0.55, 10=0.387, 100=0.2552, 500=0.189, 1000=0.1607 (USD); Mount: Surface Mount; Case/Package: 0805; Number of Pins: 2; Weight: 0.000194oz; Case Code (Imperial): 0805; Case Code (Metric): 2012; Min Operating Temperature: -55°C; Max Operating Temperature: 85°C; Voltage Rating: 16V; Capacitance: 10uF; Voltage Rating (DC): 16V; Tolerance: 10%; Packaging: Tape and Reel; Package Quantity: 2000; Dielectric: X5R; Termination: SMD/SMT; Length: 2.03mm; Height: 1.27mm; Width: 1.27mm; Thickness: 0.06inch; Depth: 1.27mm; Radiation Hardening: No; REACH SVHC: No SVHC; ComponentLink1URL: https://datasheet.ciiva.com/26948/getdatasheetpartid-132904-26948555.pdf; ComponentLink1Description: https://datasheet.ciiva.com/26948/getdatasheetpartid-132904-26948555.pdf
C37 = CAP_0805_.1u_250V: as C27 on sheet 04 DragonBoard_INTF; Supplier 1: Digi-Key; Supplier Part Number 1: 445-8883-1-ND; Stock 1: 30376; Pricing 1: 1=0.37, 10=0.25, 100=0.1419, 500=0.1002, 1000=0.0877 (USD); Case/Package: 0805; Weight: 0.000194oz; Case Code (Metric): 2012; Case Code (Imperial): 0805; Min Operating Temperature: -55°C; Max Operating Temperature: 125°C; Package Quantity: 1; Voltage Rating: 250V; Tolerance: 10%; Packaging: Tape and Reel; Voltage Rating (DC): 250V; Dielectric: X7T; Termination: SMD/SMT; Composition: Ceramic; Length: 2mm; Height: 1.25mm; Width: 0.05inch; Thickness: 0.049inch; Depth: 1.25mm; REACH SVHC: No SVHC; ComponentLink1URL: https://datasheet.ciiva.com/24219/c2012x7t2e104k125ae-265154-24219519.pdf; ComponentLink1Description: https://datasheet.ciiva.com/24219/c2012x7t2e104k125ae-265154-24219519.pdf
FAN4 = ASB0305MA-CA8Z: FAN AXIAL 30X10MM 5VDC WIRE; Manufacturer: Delta Design; Airflow: 3.4CFM; Noise: 23dBA; Current Rating: 110mA; Max Power Dissipation: 550mW; RPM: 9000RPM; Bearing Type: Sleeve; Supplier 1: Digi-Key; Supplier Part Number 1: 603-1847-ND; Manufacturer Part Number: ASB0305MA-CA8Z; Stock 1: 98; Pricing 1: 1=6.96, 10=6.38, 50=5.365 (USD); Weight: 0.015lb; Min Operating Temperature: 14°C; Max Operating Temperature: 158°C; Package Quantity: 720; Termination: 3 Wire Leads; Width: 10mm; ComponentLink1URL: //media.digikey.com/pdf/Data%20Sheets/Delta%20PDFs/ASB0305MA-CA8Z_Spec.pdf; ComponentLink1Description: //media.digikey.com/pdf/Data%20Sheets/Delta%20PDFs/ASB0305MA-CA8Z_Spec.pdf
R58-R64 R66 = RES_0805_10K: as R52 on sheet 04 DragonBoard_INTF; Supplier 1: Digi-Key; Stock 1: 1285290; Pricing 1: 1=0.1, 10=0.019, 100=0.0076, 1000=0.0034, 2500=0.003 (USD); Case/Package: 0805; Case Code (Imperial): 0805; Case Code (Metric): 2012; Contact Plating: Tin,Matte; Min Operating Temperature: -55°C; Max Operating Temperature: 155°C; Tolerance: 5%; Packaging: Tape and Reel; Termination: SMD/SMT; Composition: Thick Film; Military Standard: Not; Length: 2mm; Height: 0.5mm; Depth: 1.25mm; Width: 1.25mm; Radiation Hardening: No; REACH SVHC: Unknown; Lead Free: Lead Free; ComponentLink1URL: https://datasheet.ciiva.com/7983/444164-7983765.pdf; ComponentLink1Description: https://datasheet.ciiva.com/7983/444164-7983765.pdf; ComponentLink2URL: https://datasheet.ciiva.com/7941/444164-7941870.pdf; ComponentLink2Description: https://datasheet.ciiva.com/7941/444164-7941870.pdf; ComponentLink3URL: https://datasheet.ciiva.com/7941/444164-7941871.pdf; ComponentLink3Description: https://datasheet.ciiva.com/7941/444164-7941871.pdf; Supplier Part Number 1: 311-10KARCT-ND
R65 = RES_0805_2K: RES SMD 2K OHM 5% 1/8W 0805; Manufacturer: Yageo; Manufacturer Part Number: RC0805JR-072KL; Resistance: 2KR; Power Rating: 125mW; Voltage Rating: 150V; Temperature Coefficient: 100ppm/°C; Supplier 1: Digi-Key; Supplier Part Number 1: 311-2.0KARCT-ND; Stock 1: 297667; Pricing 1: 1=0.1, 10=0.016, 25=0.0116, 50=0.009, 100=0.0066, 250=0.005, 500=0.004, 1000=0.003 (USD); Case/Package: 0805; Number of Pins: 2; Case Code (Metric): 2012; Case Code (Imperial): 0805; Contact Plating: Tin,Lead,Matte; Min Operating Temperature: -55°C; Max Operating Temperature: 155°C; Tolerance: 5%; Packaging: Tape and Reel; Package Quantity: 1; Composition: Thick Film; Number of Terminations: 2; Termination: SMD/SMT; Military Standard: Not; Max Power Dissipation: 125mW; Voltage Rating (DC): 150V; Length: 2mm; Height: 0.024inch; Width: 0.049inch; Depth: 1.25mm; Radiation Hardening: No; REACH SVHC: No SVHC; Lead Free: Lead Free; ComponentLink1URL: https://datasheet.ciiva.com/46395/444164-46395141.pdf; ComponentLink1Description: https://datasheet.ciiva.com/46395/444164-46395141.pdf; ComponentLink2URL: https://datasheet.ciiva.com/2456/pyu-r-int-thick-7-2456104.pdf; ComponentLink2Description: https://datasheet.ciiva.com/2456/pyu-r-int-thick-7-2456104.pdf; ComponentLink3URL: https://datasheet.ciiva.com/2456/pyu-r-int-thick-7-2456105.pdf; ComponentLink3Description: https://datasheet.ciiva.com/2456/pyu-r-int-thick-7-2456105.pdf; ComponentLink4URL: https://datasheet.ciiva.com/2456/pyu-r-int-thick-7-2456106.pdf; ComponentLink4Description: https://datasheet.ciiva.com/2456/pyu-r-int-thick-7-2456106.pdf; ComponentLink5URL: https://datasheet.ciiva.com/12666/rc0805-12666941.pdf; ComponentLink5Description: https://datasheet.ciiva.com/12666/rc0805-12666941.pdf
SERVO4 = Servo_Header: Board-To-Board Connector, Vertical, WR-PHD Series, Through Hole, Header, 3 Contacts, 2.54 mm; Manufacturer: Wurth Electronics; Number of Positions: 3; Gender: Male; Connector Type: Male Pin; Pitch: 0.1inch; Supplier 1: Digi-Key; Supplier 2: Digi-Key; Supplier Part Number 1: 900-00008-ND; Supplier Part Number 2: 732-5316-ND; Manufacturer Part Number: 61300311121; Stock 2: 24543; Pricing 2: 1=0.13, 10=0.106, 25=0.088, 50=0.074, 100=0.067, 1000=0.061 (USD); Mount: Through Hole; Case/Package: 100; Contact Plating: Gold; Contact Material: Copper; Colour: Black; Number of Rows: 1; Packaging: Bulk; Termination: Solder; Number of Contacts: 3; Contact Mating Length: 0.236inch; REACH SVHC: Unknown; Lead Free: Lead Free; ComponentLink1URL: http://www.farnell.com/cad/1737268.pdf; ComponentLink1Description: http://www.farnell.com/cad/1737268.pdf
TP46 TP47 = TP: as TP10 on sheet 04 DragonBoard_INTF; Supplier 1: Digi-Key; Stock 1: 27299; Pricing 1: 1=0.21, 10=0.2, 25=0.1708, 50=0.1496, 100=0.1389, 250=0.1229, 500=0.1175, 1000=0.0962 (USD); Case/Package: 0805; Colour: Natural; Min Operating Temperature: -55°C; Max Operating Temperature: 125°C; Packaging: Tape and Reel; Package Quantity: 2000; Military Standard: Not; Length: 2mm; Depth: 1.2mm; Radiation Hardening: No; Lead Free: Lead Free; ComponentLink1URL: https://datasheet.ciiva.com/6439/eng-ds-1773266-a-6439169.pdf; ComponentLink1Description: https://datasheet.ciiva.com/6439/eng-ds-1773266-a-6439169.pdf; ComponentLink2URL: https://datasheet.ciiva.com/30238/1773266-a-30238966.pdf; ComponentLink2Description: https://datasheet.ciiva.com/30238/1773266-a-30238966.pdf; ComponentLink3URL: https://datasheet.ciiva.com/8914/eng-ds-1773266-a-8914649.pdf; ComponentLink3Description: https://datasheet.ciiva.com/8914/eng-ds-1773266-a-8914649.pdf; Supplier Part Number 1: A106144CT-ND; Mount: Surface Mount
U10 = PCA9685PW: IC LED DRIVER RGBA 28-TSSOP; Manufacturer: NXP Semiconductors; Manufacturer Part Number: PCA9685PW,118; Number of Outputs: 16; Frequency: 1MHz; Max Supply Voltage: 5.5V; Min Supply Voltage: 2.3V; Nominal Supply Current: 10A; Output Current per Channel: 25mA; High Level Output Current: 10mA; Low Level Output Current: 400A; Power Dissipation: 400W; Supplier 1: Digi-Key; Stock 1: 2599; Pricing 1: 1=2.31, 10=2.074, 100=1.6674, 500=1.3699, 1000=1.1351 (USD); Mount: Surface Mount; Case/Package: TSSOP; Number of Pins: 28; Min Operating Temperature: -40°C; Max Operating Temperature: 85°C; Packaging: Tape and Reel; Package Quantity: 2500; Output Voltage: 5.5V; Radiation Hardening: No; Lead Free: Lead Free; ComponentLink1URL: https://datasheet.ciiva.com/1947/pca9685-1947062.pdf; ComponentLink1Description: https://datasheet.ciiva.com/1947/pca9685-1947062.pdf; ComponentLink2URL: https://datasheet.ciiva.com/15134/getdatasheetpartid-103066-15134201.pdf; ComponentLink2Description: https://datasheet.ciiva.com/15134/getdatasheetpartid-103066-15134201.pdf; ComponentLink3URL: https://datasheet.ciiva.com/8125/pca9685-8125357.pdf; ComponentLink3Description: https://datasheet.ciiva.com/8125/pca9685-8125357.pdf; Supplier Part Number 1: 568-11925-1-ND

## Sheet 06 Gyro.SchDoc
size 152 x 139 mm
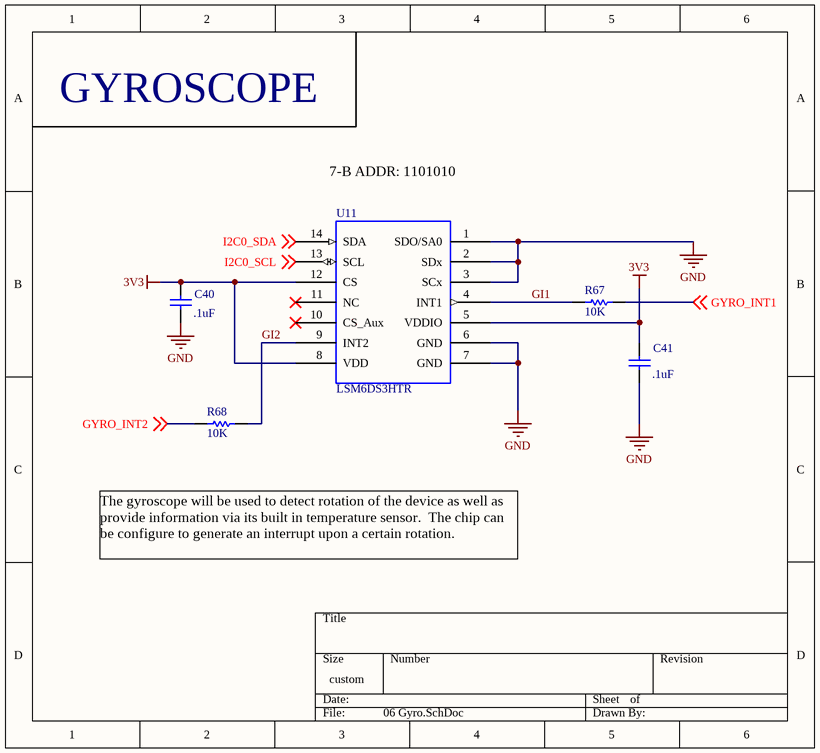
[diagram p5: 06 Gyro.SchDoc]

### Parts
C40  value .1uF  [CAPC2012X135N]  (hidden comment: CAP_0805_.1u_250V)
C41  value .1uF  [CAPC2012X135N]  (hidden comment: CAP_0805_.1u_250V)
R67  Resistance: 10K  [RES0805]  (hidden comment: RES_0805_10K)
R68  Resistance: 10K  [RES0805]  (hidden comment: RES_0805_10K)
U11  LSM6DS3HTR  [PQFN50P300X250X86_HS-15N]

### Nets
3V3: C40.2 C41.2 U11.5(VDDIO) U11.8(VDD) U11.12(CS)
GND: C40.1 C41.1 U11.1(SDO/SA0) U11.2(SDx) U11.3(SCx) U11.6(GND) U11.7(GND)
GI1: R67.1 U11.4(INT1)
GI2: R68.2 U11.9(INT2)
GYRO_INT1: R67.2 ; off-sheet GYRO_INT1
GYRO_INT2: R68.1 ; off-sheet GYRO_INT2
I2C0_SCL: U11.13(SCL) ; off-sheet I2C0_SCL
I2C0_SDA: U11.14(SDA) ; off-sheet I2C0_SDA

Not connected (* = marked no-connect by the designer): U11 10(CS_Aux)* 11(NC)*

### Notes on the sheet
- GYROSCOPE
- 7-B ADDR: 1101010
- The gyroscope will be used to detect rotation of the device as well as provide information via its built in temperature sensor.  The chip can be configure to generate an interrupt upon a certain rotation.

### Library data of the parts
C40 C41 = CAP_0805_.1u_250V: as C27 on sheet 04 DragonBoard_INTF; Supplier 1: Digi-Key; Supplier Part Number 1: 445-8883-1-ND; Stock 1: 30376; Pricing 1: 1=0.37, 10=0.25, 100=0.1419, 500=0.1002, 1000=0.0877 (USD); Case/Package: 0805; Weight: 0.000194oz; Case Code (Metric): 2012; Case Code (Imperial): 0805; Min Operating Temperature: -55°C; Max Operating Temperature: 125°C; Package Quantity: 1; Voltage Rating: 250V; Tolerance: 10%; Packaging: Tape and Reel; Voltage Rating (DC): 250V; Dielectric: X7T; Termination: SMD/SMT; Composition: Ceramic; Length: 2mm; Height: 1.25mm; Width: 0.05inch; Thickness: 0.049inch; Depth: 1.25mm; REACH SVHC: No SVHC; ComponentLink1URL: https://datasheet.ciiva.com/24219/c2012x7t2e104k125ae-265154-24219519.pdf; ComponentLink1Description: https://datasheet.ciiva.com/24219/c2012x7t2e104k125ae-265154-24219519.pdf
R67 R68 = RES_0805_10K: as R52 on sheet 04 DragonBoard_INTF; Supplier 1: Digi-Key; Stock 1: 1285290; Pricing 1: 1=0.1, 10=0.019, 100=0.0076, 1000=0.0034, 2500=0.003 (USD); Case/Package: 0805; Case Code (Imperial): 0805; Case Code (Metric): 2012; Contact Plating: Tin,Matte; Min Operating Temperature: -55°C; Max Operating Temperature: 155°C; Tolerance: 5%; Packaging: Tape and Reel; Termination: SMD/SMT; Composition: Thick Film; Military Standard: Not; Length: 2mm; Height: 0.5mm; Depth: 1.25mm; Width: 1.25mm; Radiation Hardening: No; REACH SVHC: Unknown; Lead Free: Lead Free; ComponentLink1URL: https://datasheet.ciiva.com/7983/444164-7983765.pdf; ComponentLink1Description: https://datasheet.ciiva.com/7983/444164-7983765.pdf; ComponentLink2URL: https://datasheet.ciiva.com/7941/444164-7941870.pdf; ComponentLink2Description: https://datasheet.ciiva.com/7941/444164-7941870.pdf; ComponentLink3URL: https://datasheet.ciiva.com/7941/444164-7941871.pdf; ComponentLink3Description: https://datasheet.ciiva.com/7941/444164-7941871.pdf; Supplier Part Number 1: 311-10KARCT-ND
U11 = LSM6DS3HTR: Accelerometer and Gyroscope 14-Pin LGA T/R; Manufacturer: STMicroelectronics; Supplier 1: Digi-Key; Stock 1: 31997; Pricing 1: 1=3.98, 10=3.572, 100=2.9264 (USD); Mount: Surface Mount; Contact Plating: Nickel,Gold; Min Operating Temperature: -40°C; Max Operating Temperature: 85°C; Packaging: Tape and Reel; Lead Free: Lead Free; ComponentLink1URL: http://www.st.com/content/ccc/resource/technical/document/datasheet/group0/38/96/79/af/ab/62/42/c3/DM00229854/files/DM00229854.pdf/jcr:content/translations/en.DM00229854.pdf; ComponentLink1Description: http://www.st.com/content/ccc/resource/technical/document/datasheet/group0/38/96/79/af/ab/62/42/c3/DM00229854/files/DM00229854.pdf/jcr:content/translations/en.DM00229854.pdf; Supplier Part Number 1: 497-16367-1-ND; Manufacturer Part Number: LSM6DS3HTR